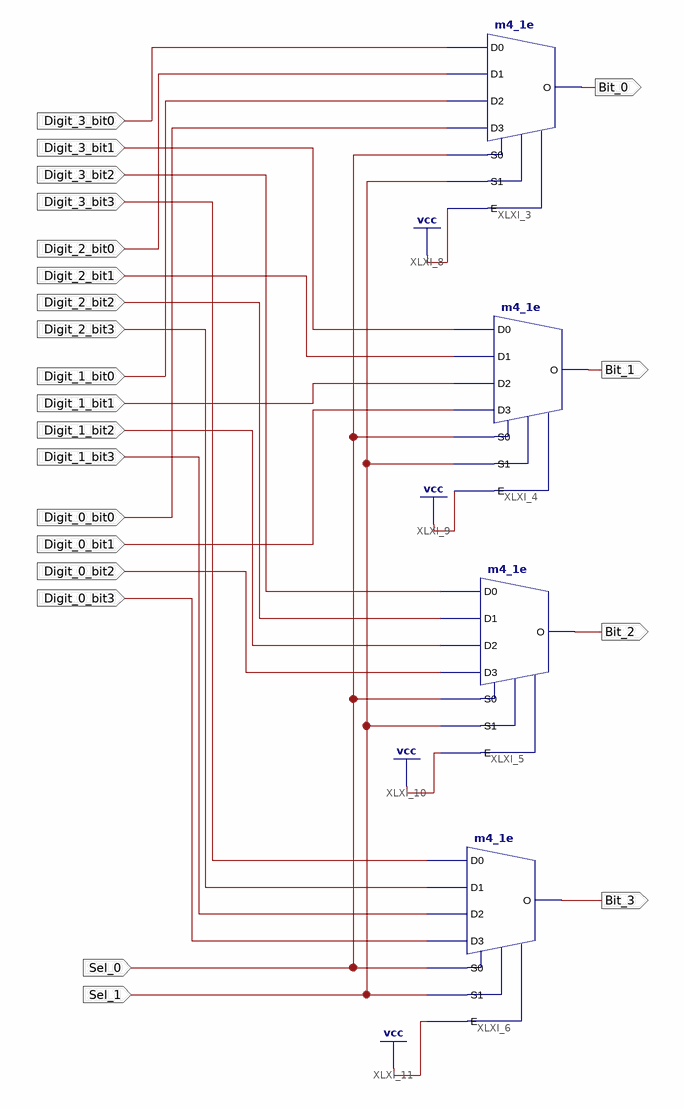
[diagram p0: schematic sheet 1]
// Xilinx ISE schematic Mux16_4.sch (spartan6) as structural Verilog: 4 symbols, 22 ports
module Mux16_4 (
  input  Digit_3_bit1,
  input  Digit_3_bit3,
  input  Digit_3_bit2,
  input  Digit_2_bit0,
  input  Digit_2_bit1,
  input  Digit_2_bit3,
  input  Digit_2_bit2,
  input  Digit_1_bit0,
  input  Digit_1_bit1,
  input  Digit_1_bit3,
  input  Digit_1_bit2,
  input  Digit_0_bit0,
  input  Digit_0_bit1,
  input  Digit_0_bit3,
  input  Digit_0_bit2,
  input  Sel_0,
  input  Sel_1,
  input  Digit_3_bit0,
  output Bit_3,
  output Bit_1,
  output Bit_0,
  output Bit_2
);

  m4_1e XLXI_3 (
    .D0(Digit_3_bit0), .D1(Digit_2_bit0), .D2(Digit_1_bit0), .D3(Digit_0_bit0), .E(1'b1), .S0(Sel_0),
    .S1(Sel_1), .O(Bit_0));
  m4_1e XLXI_6 (
    .D0(Digit_3_bit3), .D1(Digit_2_bit3), .D2(Digit_1_bit3), .D3(Digit_0_bit3), .E(1'b1), .S0(Sel_0),
    .S1(Sel_1), .O(Bit_3));
  m4_1e XLXI_4 (
    .D0(Digit_3_bit1), .D1(Digit_2_bit1), .D2(Digit_1_bit1), .D3(Digit_0_bit1), .E(1'b1), .S0(Sel_0),
    .S1(Sel_1), .O(Bit_1));
  m4_1e XLXI_5 (
    .D0(Digit_3_bit2), .D1(Digit_2_bit2), .D2(Digit_1_bit2), .D3(Digit_0_bit2), .E(1'b1), .S0(Sel_0),
    .S1(Sel_1), .O(Bit_2));
endmodule
